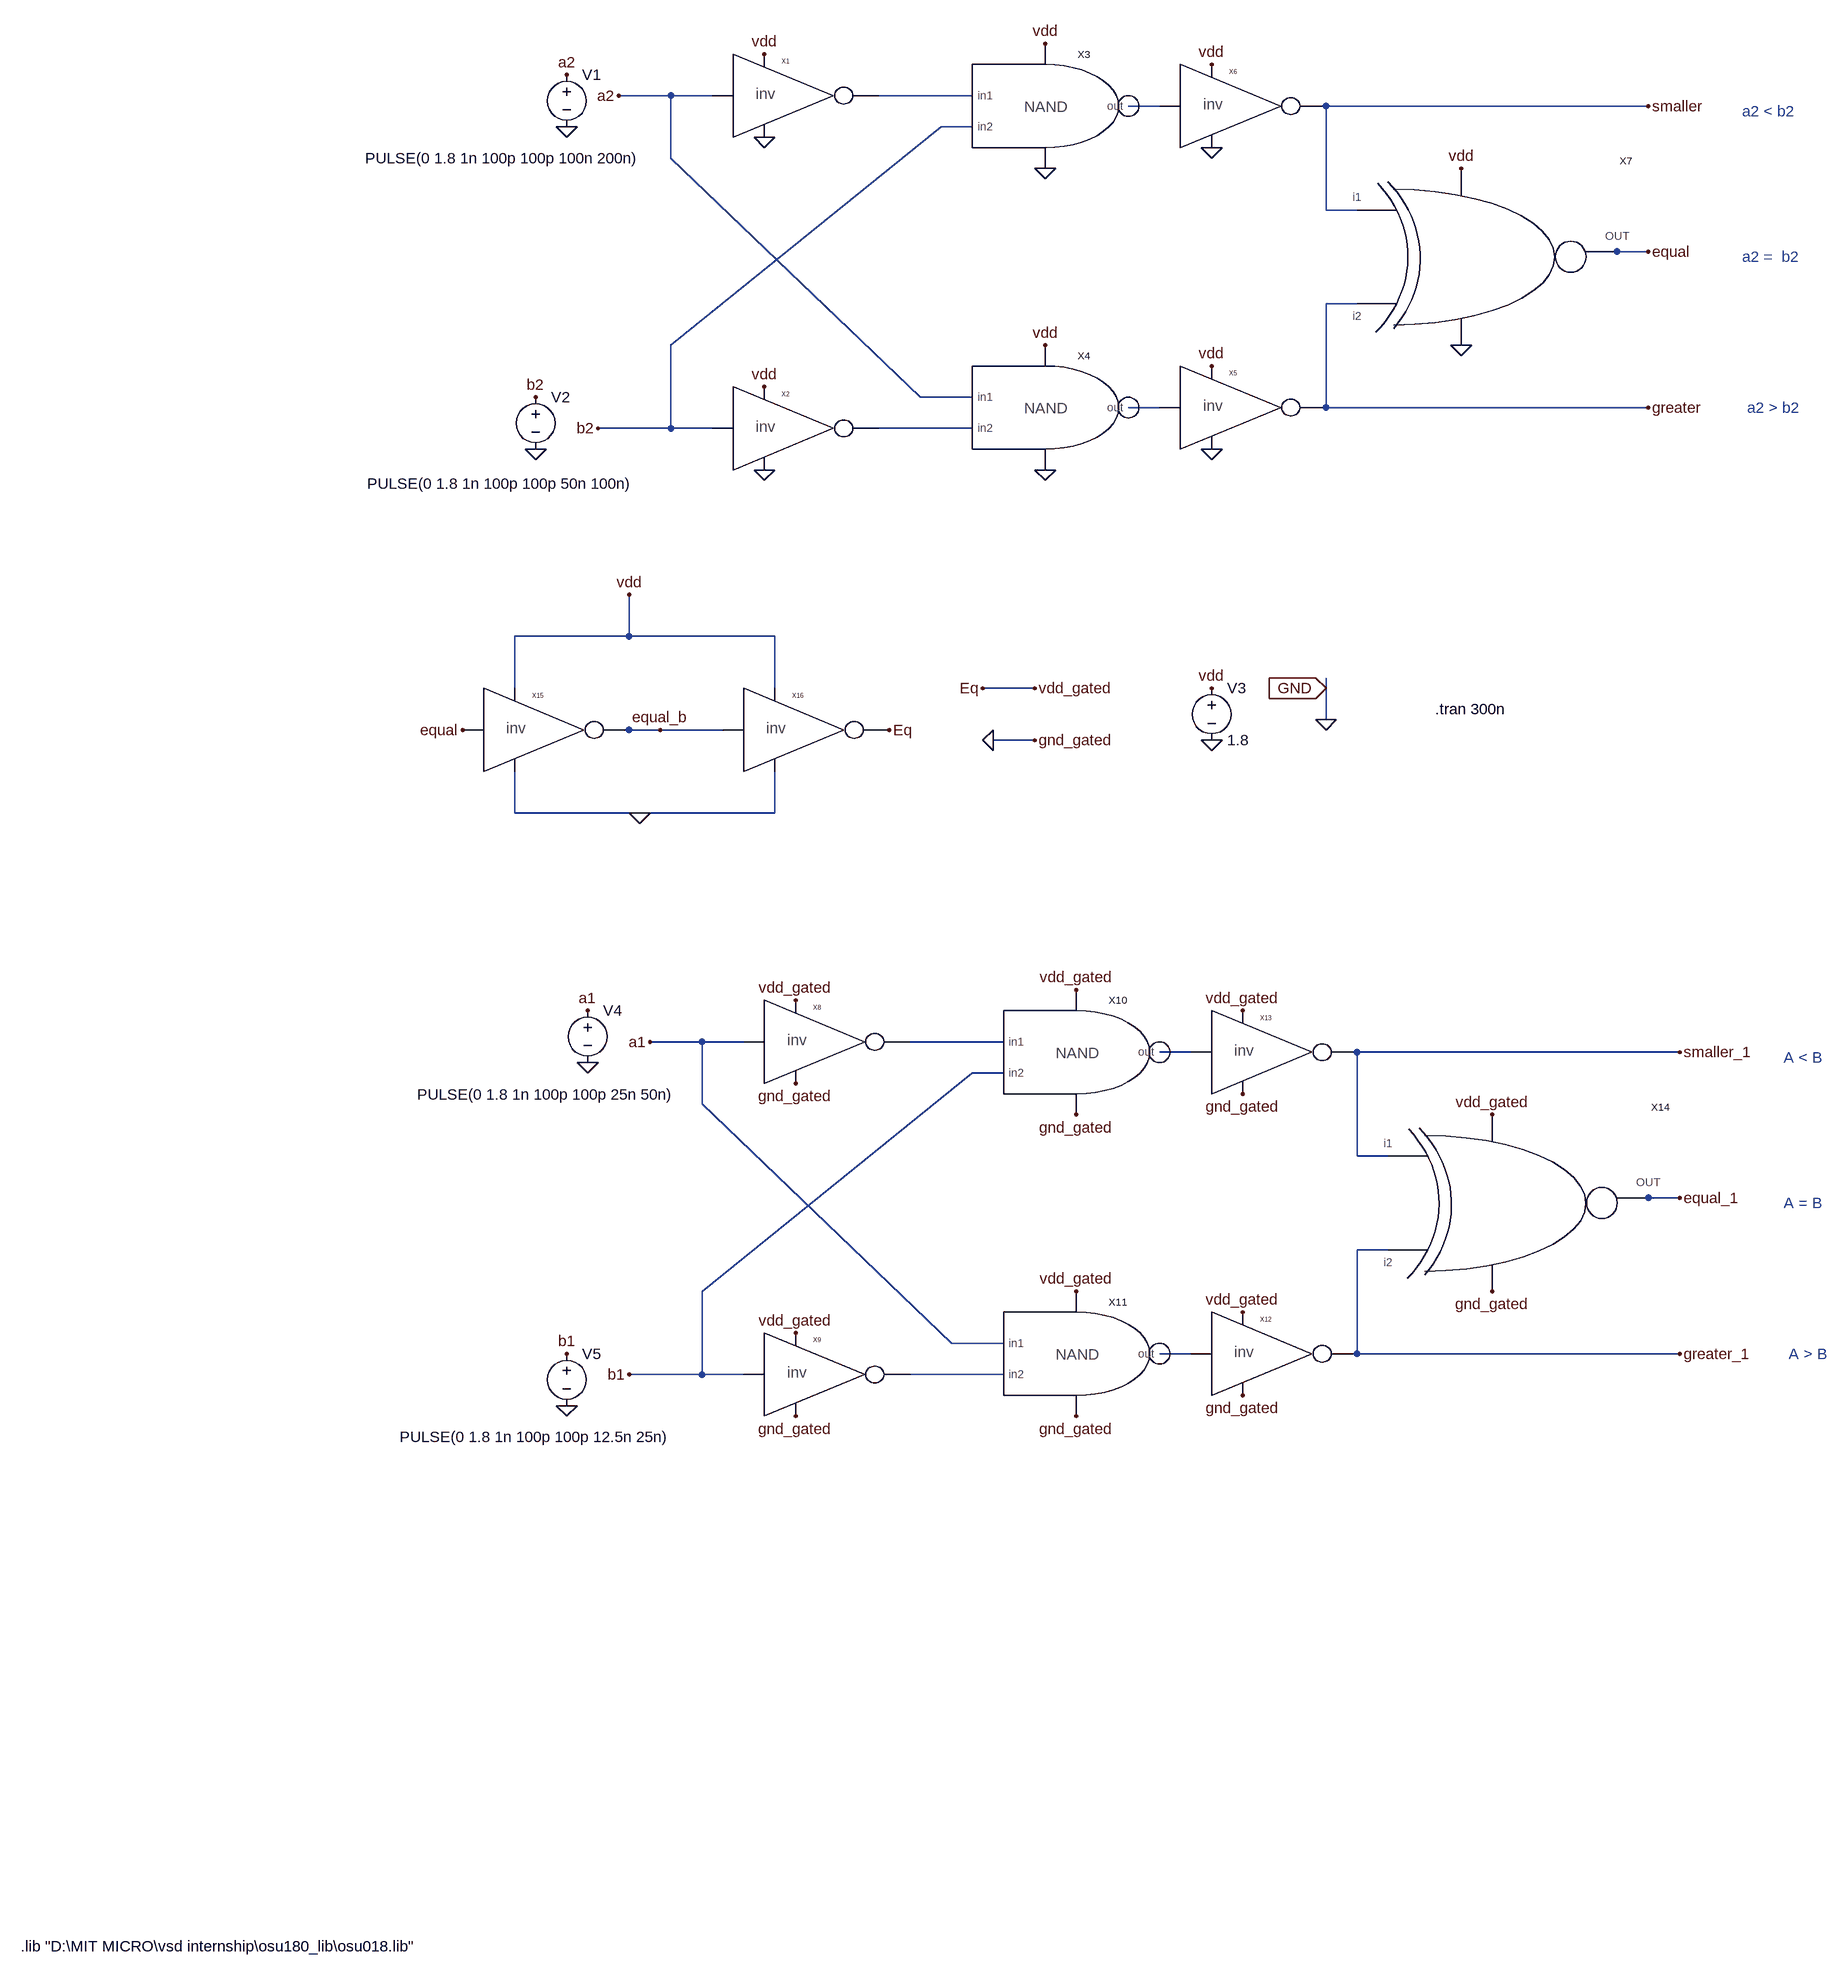
[diagram p0: schematic 2bit_comp_gating.asc]
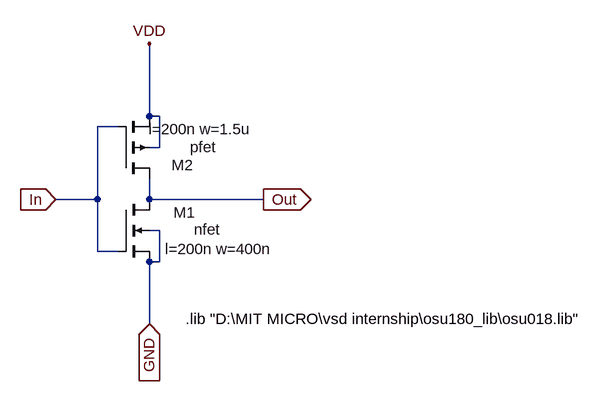
[diagram p1: sub-circuit inv_20_10.asc]
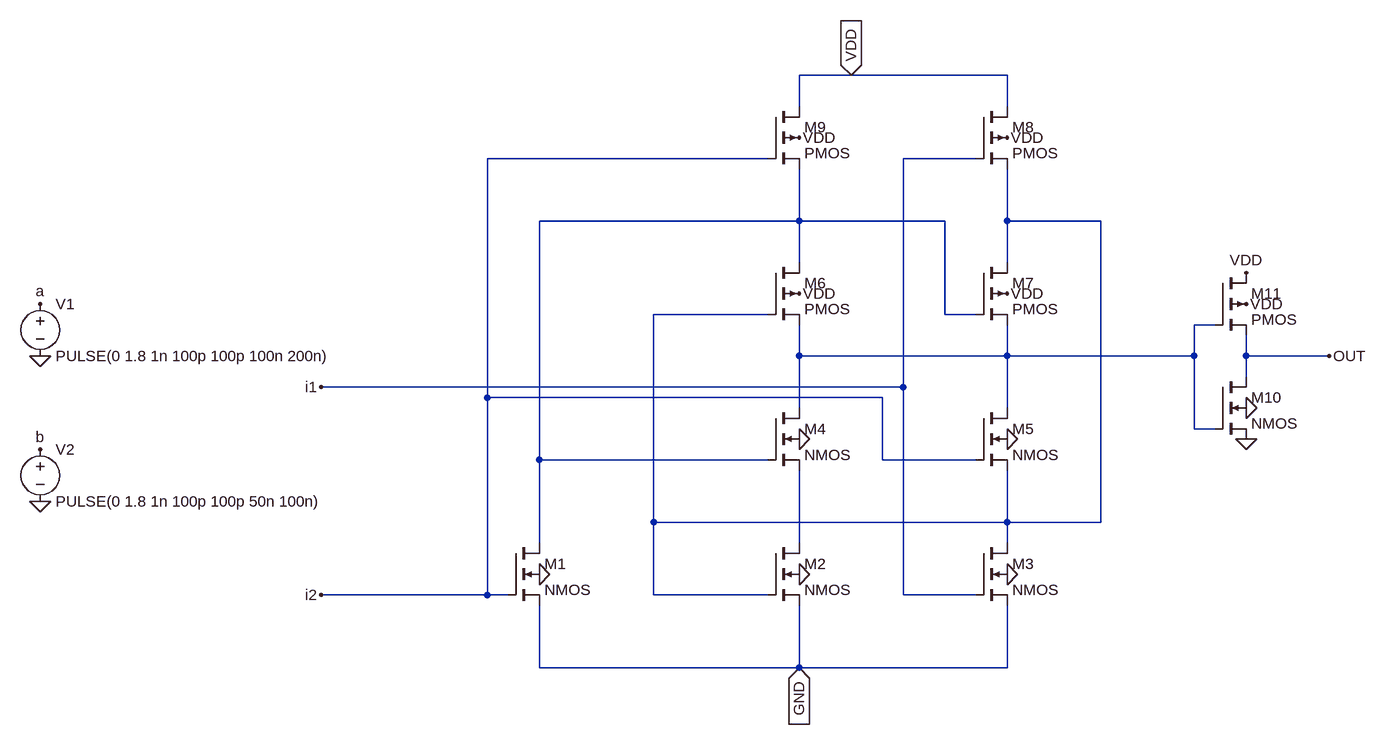
[diagram p2: sub-circuit exnor.asc]
2bit_comp_gating.asc, the LTspice schematic file:
Version 4
SHEET 1 2736 3360
WIRE -256 496 -336 496
WIRE -192 496 -256 496
WIRE 208 496 64 496
WIRE 496 512 448 512
WIRE 1248 512 752 512
WIRE 208 544 160 544
WIRE -256 592 -256 496
WIRE 752 672 752 512
WIRE 800 672 752 672
WIRE 1200 736 1152 736
WIRE 1248 736 1200 736
WIRE 800 816 752 816
WIRE -256 880 160 544
WIRE 128 960 -256 592
WIRE 208 960 128 960
WIRE 496 976 448 976
WIRE 752 976 752 816
WIRE 1248 976 752 976
WIRE -256 1008 -256 880
WIRE -256 1008 -368 1008
WIRE -192 1008 -256 1008
WIRE 208 1008 64 1008
WIRE -320 1328 -320 1264
WIRE -320 1328 -496 1328
WIRE -96 1328 -320 1328
WIRE -496 1408 -496 1328
WIRE -96 1408 -96 1328
WIRE 304 1408 224 1408
WIRE 752 1408 752 1392
WIRE 752 1456 752 1408
WIRE -320 1472 -336 1472
WIRE -272 1472 -320 1472
WIRE -176 1472 -272 1472
WIRE 304 1488 240 1488
WIRE -496 1600 -496 1536
WIRE -304 1600 -496 1600
WIRE -96 1600 -96 1536
WIRE -96 1600 -304 1600
WIRE -208 1952 -288 1952
WIRE -144 1952 -208 1952
WIRE 256 1952 112 1952
WIRE 544 1968 496 1968
WIRE 1296 1968 800 1968
WIRE 256 2000 208 2000
WIRE -208 2048 -208 1952
WIRE 800 2128 800 1968
WIRE 848 2128 800 2128
WIRE 1248 2192 1200 2192
WIRE 1296 2192 1248 2192
WIRE 848 2272 800 2272
WIRE -208 2336 208 2000
WIRE 176 2416 -208 2048
WIRE 256 2416 176 2416
WIRE 544 2432 496 2432
WIRE 800 2432 800 2272
WIRE 1296 2432 800 2432
WIRE -208 2464 -208 2336
WIRE -208 2464 -320 2464
WIRE -144 2464 -208 2464
WIRE 256 2464 112 2464
FLAG -416 544 0
FLAG -464 1040 0
FLAG 576 1488 0
FLAG -336 496 a2
FLAG -416 464 a2
FLAG -464 960 b2
FLAG 576 1408 vdd
FLAG -368 1008 b2
FLAG 1248 512 smaller
FLAG 1248 736 equal
FLAG 1248 976 greater
FLAG 752 1456 0
FLAG 752 1408 GND
IOPIN 752 1408 In
FLAG -112 432 vdd
FLAG -112 944 vdd
FLAG 320 880 vdd
FLAG 320 416 vdd
FLAG 576 448 vdd
FLAG 576 912 vdd
FLAG 960 608 vdd
FLAG 960 880 0
FLAG 576 1040 0
FLAG 320 1072 0
FLAG 576 576 0
FLAG 320 608 0
FLAG -112 1072 0
FLAG -112 560 0
FLAG -384 1984 0
FLAG -416 2512 0
FLAG -288 1952 a1
FLAG -384 1904 a1
FLAG -416 2432 b1
FLAG -320 2464 b1
FLAG 1296 1968 smaller_1
FLAG 1296 2192 equal_1
FLAG 1296 2432 greater_1
FLAG -576 1472 equal
FLAG -272 1472 equal_b
FLAG -320 1264 vdd
FLAG 304 1408 vdd_gated
FLAG -64 1888 vdd_gated
FLAG 368 1872 vdd_gated
FLAG 624 1904 vdd_gated
FLAG 1008 2064 vdd_gated
FLAG 624 2368 vdd_gated
FLAG 368 2336 vdd_gated
FLAG -64 2400 vdd_gated
FLAG 304 1488 gnd_gated
FLAG -64 2528 gnd_gated
FLAG 368 2528 gnd_gated
FLAG 624 2496 gnd_gated
FLAG 1008 2336 gnd_gated
FLAG 368 2064 gnd_gated
FLAG 624 2032 gnd_gated
FLAG -64 2016 gnd_gated
FLAG -304 1600 0
FLAG 80 1472 Eq
FLAG 224 1408 Eq
FLAG 240 1488 0
SYMBOL INV_20_10 -160 432 R0
SYMATTR InstName X1
SYMBOL INV_20_10 -160 944 R0
SYMATTR InstName X2
SYMBOL nand101 288 512 R0
SYMATTR InstName X3
SYMBOL nand101 288 976 R0
SYMATTR InstName X4
SYMBOL INV_20_10 528 912 R0
SYMATTR InstName X5
SYMBOL INV_20_10 528 448 R0
SYMATTR InstName X6
SYMBOL voltage -416 448 R0
WINDOW 3 -310 144 Left 2
SYMATTR Value PULSE(0 1.8 1n 100p 100p 100n 200n)
SYMATTR InstName V1
SYMBOL voltage -464 944 R0
WINDOW 3 -259 149 Left 2
SYMATTR Value PULSE(0 1.8 1n 100p 100p 50n 100n)
SYMATTR InstName V2
SYMBOL voltage 576 1392 R0
WINDOW 123 0 0 Left 0
WINDOW 39 0 0 Left 0
SYMATTR InstName V3
SYMATTR Value 1.8
SYMBOL exNor 896 736 R0
SYMATTR InstName X7
SYMBOL INV_20_10 -112 1888 R0
SYMATTR InstName X8
SYMBOL INV_20_10 -112 2400 R0
SYMATTR InstName X9
SYMBOL nand101 336 1968 R0
SYMATTR InstName X10
SYMBOL nand101 336 2432 R0
SYMATTR InstName X11
SYMBOL INV_20_10 576 2368 R0
SYMATTR InstName X12
SYMBOL INV_20_10 576 1904 R0
SYMATTR InstName X13
SYMBOL voltage -384 1888 R0
WINDOW 123 0 0 Left 0
WINDOW 39 0 0 Left 0
WINDOW 3 -262 145 Left 2
SYMATTR Value PULSE(0 1.8 1n 100p 100p 25n 50n)
SYMATTR InstName V4
SYMBOL voltage -416 2416 R0
WINDOW 123 0 0 Left 0
WINDOW 39 0 0 Left 0
WINDOW 3 -257 144 Left 2
SYMATTR Value PULSE(0 1.8 1n 100p 100p 12.5n 25n)
SYMATTR InstName V5
SYMBOL exNor 944 2192 R0
SYMATTR InstName X14
SYMBOL INV_20_10 -544 1408 R0
SYMATTR InstName X15
SYMBOL INV_20_10 -144 1408 R0
SYMATTR InstName X16
TEXT 1392 520 Left 2 ;a2 < b2
TEXT 1392 744 Left 2 ;a2 =  b2
TEXT 1400 976 Left 2 ;a2 > b2
TEXT 920 1440 Left 2 !.tran 300n
TEXT 1456 1976 Left 2 ;A < B
TEXT 1456 2200 Left 2 ;A = B
TEXT 1464 2432 Left 2 ;A > B
TEXT -1256 3344 Left 2 !.lib "D:\\MIT MICRO\\vsd internship\\osu180_lib\\osu018.lib"

inv_20_10.asc, the sub-circuit schematic file:
Version 4
SHEET 1 1196 680
WIRE 448 -304 448 -416
WIRE 464 -304 448 -304
WIRE 400 -288 368 -288
WIRE 464 -256 464 -304
WIRE 464 -256 448 -256
WIRE 368 -176 368 -288
WIRE 368 -176 304 -176
WIRE 448 -176 448 -208
WIRE 624 -176 448 -176
WIRE 464 -128 448 -128
WIRE 368 -96 368 -176
WIRE 400 -96 368 -96
WIRE 464 -80 464 -128
WIRE 464 -80 448 -80
WIRE 448 16 448 -80
FLAG 304 -176 In
IOPIN 304 -176 In
FLAG 624 -176 Out
IOPIN 624 -176 Out
FLAG 448 -416 VDD
FLAG 448 16 GND
IOPIN 448 16 In
SYMBOL nmos4 400 -176 R0
WINDOW 0 119 20 Right 2
WINDOW 3 157 46 Right 2
WINDOW 123 238 76 Right 2
SYMATTR InstName M1
SYMATTR Value nfet
SYMATTR Value2 l=200n w=400n
SYMBOL pmos4 400 -208 M180
WINDOW 0 116 21 Right 2
WINDOW 3 151 49 Right 2
WINDOW 123 206 76 Right 2
SYMATTR InstName M2
SYMATTR Value pfet
SYMATTR Value2 l=200n w=1.5u
TEXT 504 8 Left 2 !.lib "D:\\MIT MICRO\\vsd internship\\osu180_lib\\osu018.lib"

exnor.asc, the sub-circuit schematic file:
Version 4
SHEET 1 1412 680
WIRE 528 -624 448 -624
WIRE 768 -624 528 -624
WIRE 448 -576 448 -624
WIRE 768 -576 768 -624
WIRE 400 -496 -32 -496
WIRE 720 -496 608 -496
WIRE 448 -400 448 -480
WIRE 448 -400 48 -400
WIRE 672 -400 448 -400
WIRE 768 -400 768 -480
WIRE 912 -400 768 -400
WIRE 448 -336 448 -400
WIRE 768 -336 768 -400
WIRE 400 -256 224 -256
WIRE 672 -256 672 -400
WIRE 720 -256 672 -256
WIRE 1088 -240 1056 -240
WIRE 448 -192 448 -240
WIRE 768 -192 768 -240
WIRE 768 -192 448 -192
WIRE 1056 -192 1056 -240
WIRE 1056 -192 768 -192
WIRE 1136 -192 1136 -224
WIRE 1264 -192 1136 -192
WIRE 1136 -160 1136 -192
WIRE 608 -144 608 -496
WIRE 608 -144 -288 -144
WIRE -32 -128 -32 -496
WIRE 576 -128 -32 -128
WIRE 448 -112 448 -192
WIRE 768 -112 768 -192
WIRE 1056 -80 1056 -192
WIRE 1088 -80 1056 -80
WIRE 48 -32 48 -400
WIRE 400 -32 48 -32
WIRE 576 -32 576 -128
WIRE 720 -32 576 -32
WIRE 224 64 224 -256
WIRE 768 64 768 -16
WIRE 768 64 224 64
WIRE 912 64 912 -400
WIRE 912 64 768 64
WIRE 48 96 48 -32
WIRE 448 96 448 -16
WIRE 768 96 768 64
WIRE -32 176 -32 -128
WIRE -32 176 -288 176
WIRE 0 176 -32 176
WIRE 224 176 224 64
WIRE 400 176 224 176
WIRE 608 176 608 -144
WIRE 720 176 608 176
WIRE 48 288 48 192
WIRE 448 288 448 192
WIRE 448 288 48 288
WIRE 768 288 768 192
WIRE 768 288 448 288
FLAG -720 -272 a
FLAG -720 -48 b
FLAG -288 -144 i1
FLAG -288 176 i2
FLAG -720 -192 0
FLAG -720 32 0
FLAG 48 144 0
FLAG 448 144 0
FLAG 768 144 0
FLAG 768 -64 0
FLAG 448 -64 0
FLAG 448 -288 VDD
FLAG 448 -528 VDD
FLAG 768 -528 VDD
FLAG 768 -288 VDD
FLAG 1136 -112 0
FLAG 1136 -64 0
FLAG 1136 -320 VDD
FLAG 1136 -272 VDD
FLAG 1264 -192 OUT
FLAG 448 288 GND
IOPIN 448 288 In
FLAG 528 -624 VDD
IOPIN 528 -624 In
SYMBOL voltage -720 -288 R0
SYMATTR InstName V1
SYMATTR Value PULSE(0 1.8 1n 100p 100p 100n 200n)
SYMBOL voltage -720 -64 R0
WINDOW 123 0 0 Left 0
WINDOW 39 0 0 Left 0
SYMATTR InstName V2
SYMATTR Value PULSE(0 1.8 1n 100p 100p 50n 100n)
SYMBOL nmos4 0 96 R0
SYMATTR InstName M1
SYMBOL nmos4 400 96 R0
SYMATTR InstName M2
SYMBOL nmos4 720 96 R0
SYMATTR InstName M3
SYMBOL nmos4 400 -112 R0
SYMATTR InstName M4
SYMBOL nmos4 720 -112 R0
SYMATTR InstName M5
SYMBOL pmos4 400 -336 R0
SYMATTR InstName M6
SYMBOL pmos4 720 -336 R0
SYMATTR InstName M7
SYMBOL pmos4 720 -576 R0
SYMATTR InstName M8
SYMBOL pmos4 400 -576 R0
SYMATTR InstName M9
SYMBOL nmos4 1088 -160 R0
SYMATTR InstName M10
SYMBOL pmos4 1088 -320 R0
SYMATTR InstName M11

The netlist it stands for:
* 2bit_comp_gating.asc
XX1 a2 N001 vdd 0 inv_20_10
XX2 b2 N004 vdd 0 inv_20_10
XX3 N001 b2 N002 vdd 0 nand101  ; pins in1 in2 out VDD GND
XX4 a2 N004 N003 vdd 0 nand101  ; pins in1 in2 out VDD GND
XX5 N003 greater vdd 0 inv_20_10
XX6 N002 smaller vdd 0 inv_20_10
V1 a2 0 PULSE(0 1.8 1n 100p 100p 100n 200n)
V2 b2 0 PULSE(0 1.8 1n 100p 100p 50n 100n)
V3 vdd 0 1.8
XX7 smaller greater equal vdd 0 exnor
XX8 a1 N005 Eq 0 inv_20_10
XX9 b1 N008 Eq 0 inv_20_10
XX10 N005 b1 N006 Eq 0 nand101  ; pins in1 in2 out VDD GND
XX11 a1 N008 N007 Eq 0 nand101  ; pins in1 in2 out VDD GND
XX12 N007 greater_1 Eq 0 inv_20_10
XX13 N006 smaller_1 Eq 0 inv_20_10
V4 a1 0 PULSE(0 1.8 1n 100p 100p 25n 50n)
V5 b1 0 PULSE(0 1.8 1n 100p 100p 12.5n 25n)
XX14 smaller_1 greater_1 equal_1 Eq 0 exnor
XX15 equal equal_b vdd 0 inv_20_10
XX16 equal_b Eq vdd 0 inv_20_10

* block symbol definitions
.subckt inv_20_10 In Out VDD GND
M1 Out In GND GND nfet l=200n w=400n
M2 Out In VDD VDD pfet l=200n w=1.5u
.lib "D:\MIT MICRO\vsd internship\osu180_lib\osu018.lib"
.ends inv_20_10

.subckt exnor i1 i2 OUT VDD GND
V1 a 0 PULSE(0 1.8 1n 100p 100p 100n 200n)
V2 b 0 PULSE(0 1.8 1n 100p 100p 50n 100n)
M1 N001 i2 GND 0 NMOS
M2 N004 N002 GND 0 NMOS
M3 N002 i1 GND 0 NMOS
M4 N003 N001 N004 0 NMOS
M5 N003 i2 N002 0 NMOS
M6 N001 N002 N003 VDD PMOS
M7 N002 N001 N003 VDD PMOS
M8 VDD i1 N002 VDD PMOS
M9 VDD i2 N001 VDD PMOS
M10 OUT N003 0 0 NMOS
M11 VDD N003 OUT VDD PMOS
.ends exnor

.model NMOS NMOS
.model PMOS PMOS
.lib standard.mos
* a2 < b2
* a2 =  b2
* a2 > b2
.tran 300n
* A < B
* A = B
* A > B
.lib "D:\MIT MICRO\vsd internship\osu180_lib\osu018.lib"
.backanno
.end